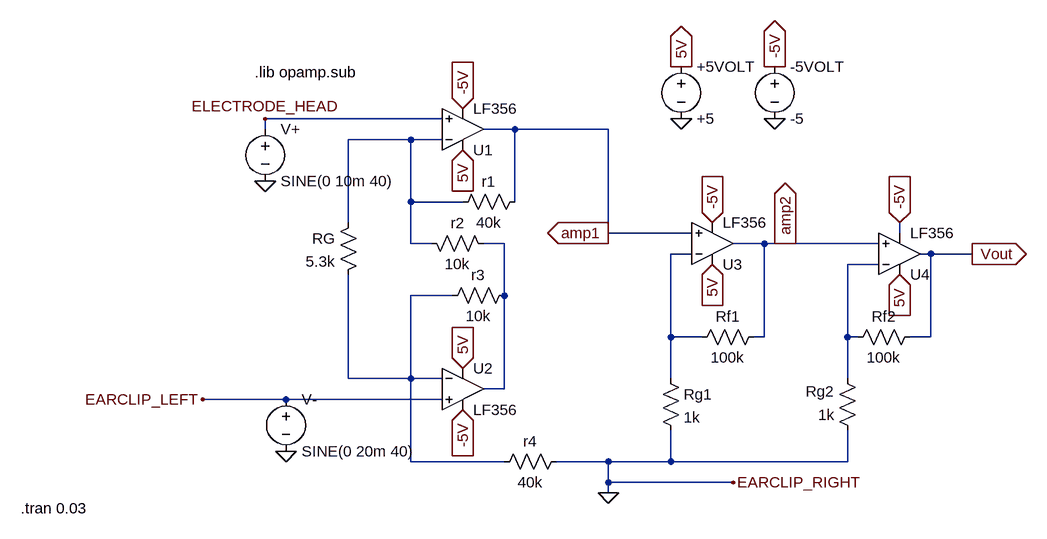
[diagram p0: schematic InAmp.asc]
InAmp.asc, the LTspice schematic file:
Version 4
SHEET 1 976 732
WIRE 48 -80 -224 -80
WIRE -224 -64 -224 -80
WIRE 160 -64 112 -64
WIRE 304 -64 160 -64
WIRE 0 -48 -96 -48
WIRE 48 -48 0 -48
WIRE 0 48 0 -48
WIRE 80 48 0 48
WIRE 160 48 160 -64
WIRE -96 80 -96 -48
WIRE 304 96 304 -64
WIRE 432 96 304 96
WIRE 752 96 752 80
WIRE 0 112 0 48
WIRE 32 112 0 112
WIRE 144 112 112 112
WIRE 544 112 496 112
WIRE 576 112 544 112
WIRE 720 112 576 112
WIRE 432 128 400 128
WIRE 800 128 784 128
WIRE 864 128 800 128
WIRE 720 144 672 144
WIRE 64 192 0 192
WIRE 144 192 144 112
WIRE 400 256 400 128
WIRE 448 256 400 256
WIRE 544 256 544 112
WIRE 544 256 528 256
WIRE 672 256 672 144
WIRE 688 256 672 256
WIRE 800 256 800 128
WIRE 800 256 768 256
WIRE -96 320 -96 160
WIRE 0 320 0 192
WIRE 0 320 -96 320
WIRE 48 320 0 320
WIRE 400 320 400 256
WIRE 672 320 672 256
WIRE 144 336 144 192
WIRE 144 336 112 336
WIRE -192 352 -320 352
WIRE 48 352 -192 352
WIRE 0 448 0 320
WIRE 144 448 0 448
WIRE 304 448 224 448
WIRE 400 448 400 400
WIRE 400 448 304 448
WIRE 672 448 672 400
WIRE 672 448 400 448
WIRE 304 480 304 448
WIRE 496 480 304 480
WIRE 304 496 304 480
FLAG 80 -32 5V
IOPIN 80 -32 In
FLAG 80 304 5V
IOPIN 80 304 In
FLAG 464 144 5V
IOPIN 464 144 In
FLAG 752 160 5V
IOPIN 752 160 In
FLAG 416 -160 5V
IOPIN 416 -160 Out
FLAG 560 -160 -5V
IOPIN 560 -160 Out
FLAG 416 -80 0
FLAG 560 -80 0
FLAG 864 128 Vout
IOPIN 864 128 Out
FLAG 304 96 amp1
IOPIN 304 96 Out
FLAG 576 112 amp2
IOPIN 576 112 Out
FLAG -224 16 0
FLAG -192 432 0
FLAG 752 80 -5V
IOPIN 752 80 In
FLAG 464 80 -5V
IOPIN 464 80 In
FLAG 80 368 -5V
IOPIN 80 368 In
FLAG 80 -96 -5V
IOPIN 80 -96 In
FLAG -224 -80 ELECTRODE_HEAD
FLAG 304 496 0
FLAG 496 480 EARCLIP_RIGHT
FLAG -320 352 EARCLIP_LEFT
SYMBOL OpAmps\\LF356 80 0 M180
SYMATTR InstName U1
SYMBOL OpAmps\\LF356 80 272 R0
SYMATTR InstName U2
SYMBOL OpAmps\\LF356 464 176 M180
SYMATTR InstName U3
SYMBOL OpAmps\\LF356 752 192 M180
SYMATTR InstName U4
SYMBOL res -80 64 M0
SYMATTR InstName RG
SYMATTR Value 5.3k
SYMBOL res 176 32 R90
WINDOW 0 0 56 VBottom 2
WINDOW 3 32 56 VTop 2
SYMATTR InstName r1
SYMATTR Value 40k
SYMBOL res 160 176 R90
WINDOW 0 0 56 VBottom 2
WINDOW 3 32 56 VTop 2
SYMATTR InstName r3
SYMATTR Value 10k
SYMBOL res 16 96 M90
WINDOW 0 0 56 VBottom 2
WINDOW 3 32 56 VTop 2
SYMATTR InstName r2
SYMATTR Value 10k
SYMBOL voltage 416 -176 R0
WINDOW 123 0 0 Left 0
WINDOW 39 0 0 Left 0
SYMATTR InstName +5VOLT
SYMATTR Value +5
SYMBOL voltage 560 -176 R0
WINDOW 123 0 0 Left 0
WINDOW 39 0 0 Left 0
SYMATTR InstName -5VOLT
SYMATTR Value -5
SYMBOL voltage -224 -80 R0
WINDOW 123 0 0 Left 0
WINDOW 39 0 0 Left 0
SYMATTR InstName V+
SYMATTR Value SINE(0 10m 40)
SYMBOL res 240 432 R90
WINDOW 0 0 56 VBottom 2
WINDOW 3 32 56 VTop 2
SYMATTR InstName r4
SYMATTR Value 40k
SYMBOL res 384 304 R0
SYMATTR InstName Rg1
SYMATTR Value 1k
SYMBOL res 544 240 R90
WINDOW 0 0 56 VBottom 2
WINDOW 3 32 56 VTop 2
SYMATTR InstName Rf1
SYMATTR Value 100k
SYMBOL res 688 416 R180
WINDOW 0 36 76 Left 2
WINDOW 3 36 40 Left 2
SYMATTR InstName Rg2
SYMATTR Value 1k
SYMBOL res 672 272 R270
WINDOW 0 32 56 VTop 2
WINDOW 3 0 56 VBottom 2
SYMATTR InstName Rf2
SYMATTR Value 100k
SYMBOL voltage -192 336 R0
WINDOW 123 0 0 Left 0
WINDOW 39 0 0 Left 0
SYMATTR InstName V-
SYMATTR Value SINE(0 20m 40)
TEXT -240 -152 Left 2 !.lib opamp.sub
TEXT -600 520 Left 2 !.tran 0.03

The netlist it stands for:
* InAmp.asc
XU1 ELECTRODE_HEAD N001 5V -5V amp1 LF356  ; pins In+ In- V+ V- OUT
XU2 EARCLIP_LEFT N005 5V -5V N002 LF356  ; pins In+ In- V+ V- OUT
XU3 amp1 N003 5V -5V amp2 LF356  ; pins In+ In- V+ V- OUT
XU4 amp2 N004 5V -5V Vout LF356  ; pins In+ In- V+ V- OUT
RG N001 N005 5.3k
r1 amp1 N001 40k
r3 N002 N005 10k
r2 N001 N002 10k
V§+5VOLT 5V 0 +5
V§-5VOLT -5V 0 -5
V+ ELECTRODE_HEAD 0 SINE(0 10m 40)
r4 0 N005 40k
Rg1 N003 0 1k
Rf1 amp2 N003 100k
Rg2 0 N004 1k
Rf2 N004 Vout 100k
V- EARCLIP_LEFT 0 SINE(0 20m 40)
.lib opamp.sub
.tran 0.03
.lib LF356.sub
.backanno
.end